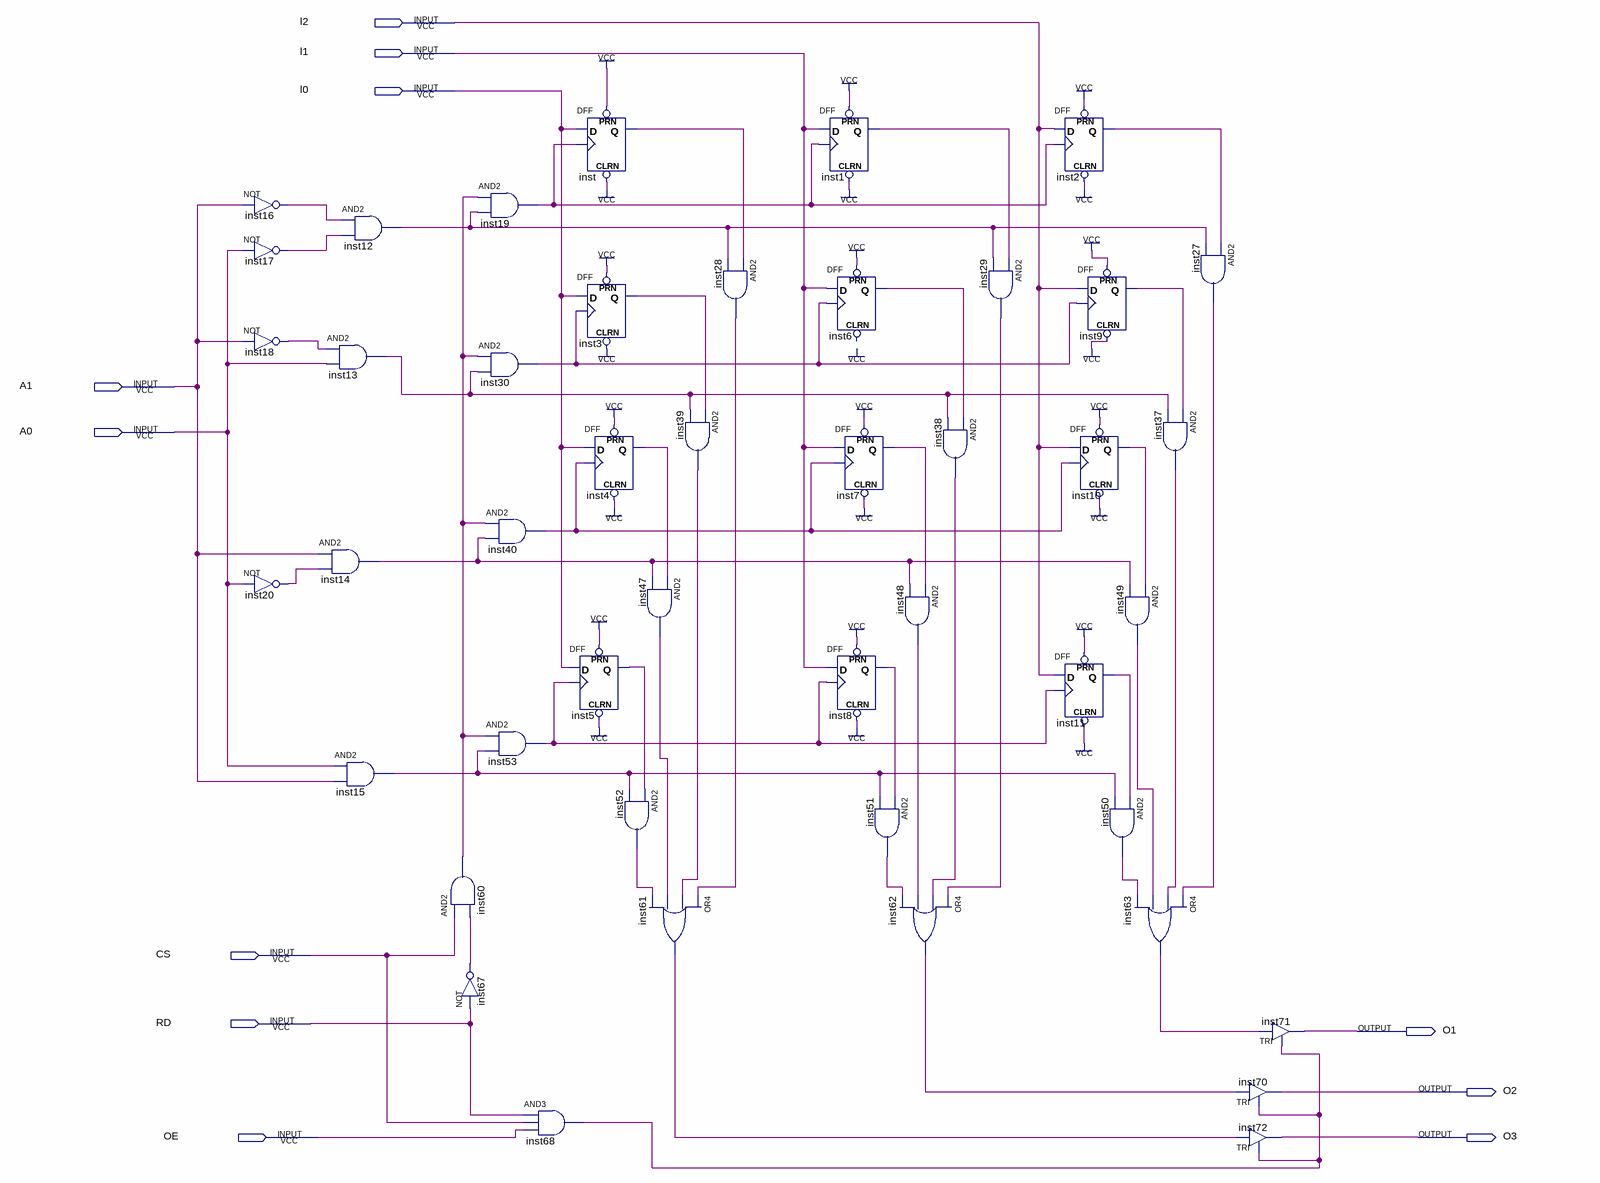
[diagram p0: schematic sheet]
// Quartus schematic mem_4x3.bdf as structural Verilog: 45 symbols, 11 pins
module mem_4x3 (
  input  l2,
  input  l1,
  input  l0,
  input  A1,
  input  A0,
  input  CS,
  input  RD,
  input  OE,
  output O1,
  output O2,
  output O3
);

  wire inst1_q, inst2_q, inst3_q, inst4_q, inst5_q, inst6_q, inst7_q, inst8_q, inst9_q, inst10_q, inst11_q,
       inst12_out, inst13_out, inst14_out, inst15_out, inst16_out, inst17_out, inst18_out, inst19_out,
       inst20_out, inst27_out, inst28_out, inst29_out, inst30_out, inst37_out, inst38_out, inst39_out,
       inst40_out, inst47_out, inst48_out, inst49_out, inst50_out, inst51_out, inst52_out, inst53_out,
       inst60_out, inst61_out, inst62_out, inst63_out, inst67_out, inst68_out, inst_q;

  not inst16 (inst16_out, A1);
  not inst17 (inst17_out, A0);
  not inst18 (inst18_out, A1);
  not inst20 (inst20_out, A0);
  and inst12 (inst12_out, inst16_out, inst17_out);
  and inst13 (inst13_out, inst18_out, A0);
  and inst14 (inst14_out, A1, inst20_out);
  and inst15 (inst15_out, A0, A1);
  and inst19 (inst19_out, inst60_out, inst12_out);
  and inst30 (inst30_out, inst60_out, inst13_out);
  and inst60 (inst60_out, CS, inst67_out);
  not inst67 (inst67_out, RD);
  and inst40 (inst40_out, inst60_out, inst14_out);
  and inst53 (inst53_out, inst60_out, inst15_out);
  and inst68 (inst68_out, RD, CS, OE);
  DFF inst (.CLRN(1'b1), .CLK(inst19_out), .D(l0), .PRN(1'b1), .Q(inst_q));
  DFF inst3 (.CLRN(1'b1), .CLK(inst30_out), .D(l0), .PRN(1'b1), .Q(inst3_q));
  DFF inst4 (.CLRN(1'b1), .CLK(inst40_out), .D(l0), .PRN(1'b1), .Q(inst4_q));
  DFF inst5 (.CLRN(1'b1), .CLK(inst53_out), .D(l0), .PRN(1'b1), .Q(inst5_q));
  and inst47 (inst47_out, inst4_q, inst14_out);
  and inst52 (inst52_out, inst5_q, inst15_out);
  or inst61 (inst61_out, inst28_out, inst39_out, inst47_out, inst52_out);
  and inst28 (inst28_out, inst_q, inst12_out);
  and inst39 (inst39_out, inst3_q, inst13_out);
  DFF inst1 (.CLRN(1'b1), .CLK(inst19_out), .D(l1), .PRN(1'b1), .Q(inst1_q));
  DFF inst6 (.CLK(inst30_out), .D(l1), .PRN(1'b1), .Q(inst6_q));  // open: CLRN
  DFF inst7 (.CLRN(1'b1), .CLK(inst40_out), .D(l1), .PRN(1'b1), .Q(inst7_q));
  DFF inst8 (.CLRN(1'b1), .CLK(inst53_out), .D(l1), .PRN(1'b1), .Q(inst8_q));
  and inst48 (inst48_out, inst7_q, inst14_out);
  and inst51 (inst51_out, inst8_q, inst15_out);
  or inst62 (inst62_out, inst29_out, inst38_out, inst48_out, inst51_out);
  and inst38 (inst38_out, inst6_q, inst13_out);
  and inst29 (inst29_out, inst1_q, inst12_out);
  DFF inst2 (.CLRN(1'b1), .CLK(inst19_out), .D(l2), .PRN(1'b1), .Q(inst2_q));
  DFF inst9 (.CLRN(1'b1), .CLK(inst30_out), .D(l2), .PRN(1'b1), .Q(inst9_q));
  DFF inst10 (.CLRN(1'b1), .CLK(inst40_out), .D(l2), .PRN(1'b1), .Q(inst10_q));
  DFF inst11 (.CLRN(1'b1), .CLK(inst53_out), .D(l2), .PRN(1'b1), .Q(inst11_q));
  and inst49 (inst49_out, inst10_q, inst14_out);
  and inst50 (inst50_out, inst11_q, inst15_out);
  or inst63 (inst63_out, inst27_out, inst37_out, inst49_out, inst50_out);
  and inst27 (inst27_out, inst2_q, inst12_out);
  and inst37 (inst37_out, inst9_q, inst13_out);
  TRI inst71 (.IN(inst63_out), .OE(inst68_out), .OUT(O1));
  TRI inst70 (.IN(inst62_out), .OE(inst68_out), .OUT(O2));
  TRI inst72 (.IN(inst61_out), .OE(inst68_out), .OUT(O3));
endmodule
